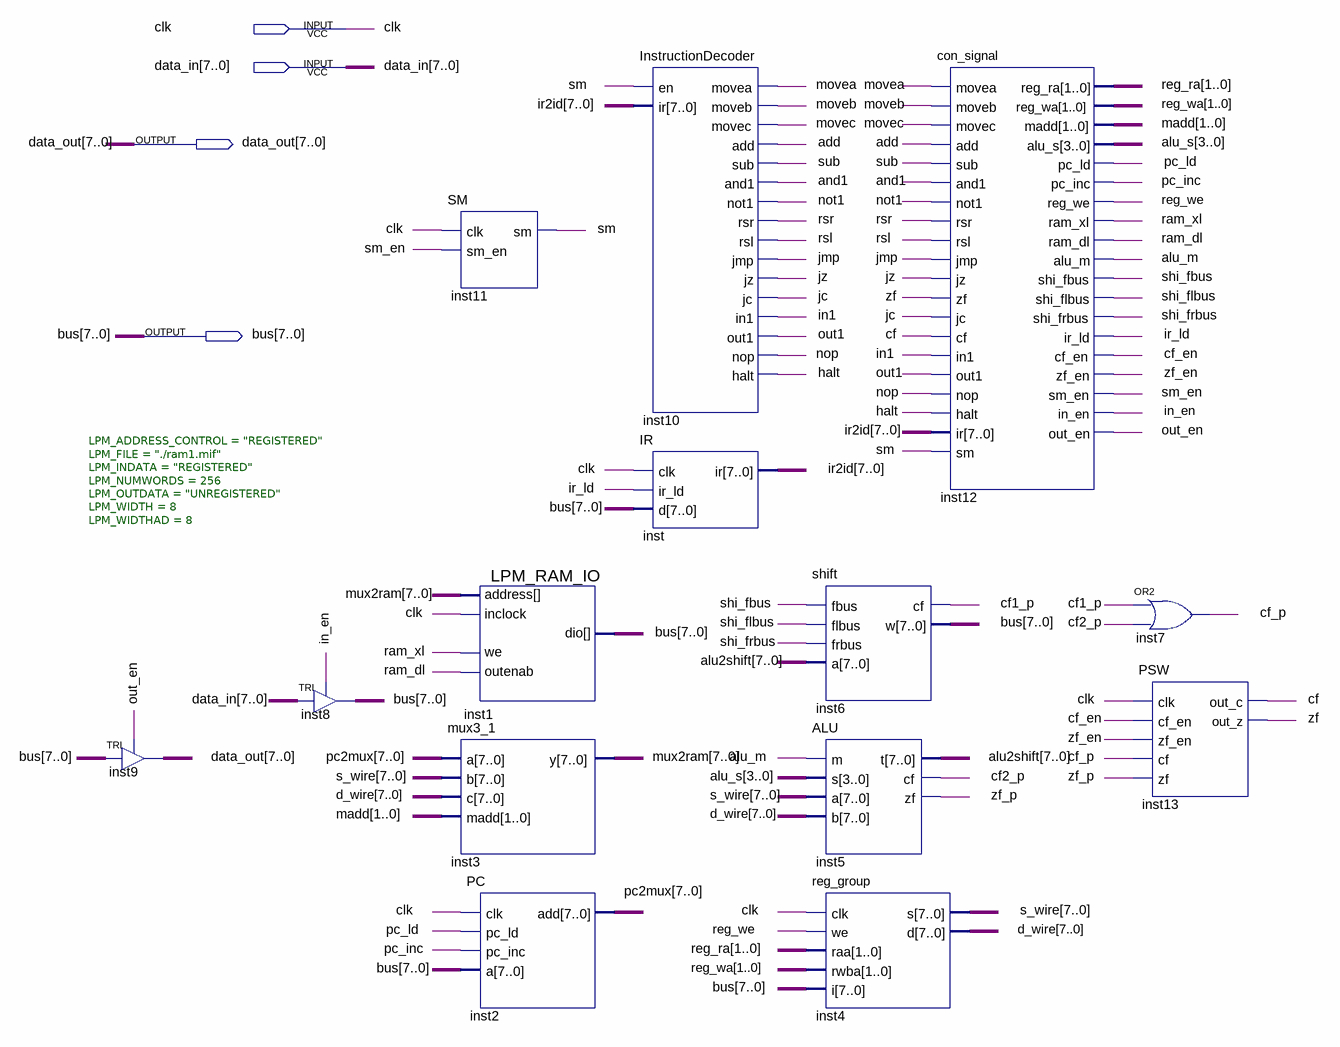
[diagram p0: schematic sheet]
// Quartus schematic ModelMachine.bdf as structural Verilog: 14 symbols, 4 pins
module ModelMachine (
  input  clk,
  input  [7:0] data_in,
  output [7:0] data_out,
  output [7:0] bus
);

  wire add, alu_m, and1, cf, cf1_p, cf2_p, cf_en, cf_p, halt, in1, in_en, ir_ld, jc, jmp, jz, movea, moveb,
       movec, nop, not1, out1, out_en, pc_inc, pc_ld, ram_dl, ram_xl, reg_we, rsl, rsr, shi_fbus, shi_flbus,
       shi_frbus, sm, sm_en, sub, zf, zf_en, zf_p;
  wire [1:0] madd, reg_ra, reg_wa;
  wire [3:0] alu_s;
  wire [7:0] alu2shift, d_wire, ir2id, mux2ram, pc2mux, s_wire;

  TRI inst9[7:0] (.IN(bus), .OE(out_en), .OUT(data_out));
  TRI inst8[7:0] (.IN(data_in), .OE(in_en), .OUT(bus));
  SM inst11 (.clk(clk), .sm_en(sm_en), .sm(sm));
  LPM_RAM_IO #(.LPM_ADDRESS_CONTROL("REGISTERED"), .LPM_FILE("./ram1.mif"), .LPM_INDATA("REGISTERED"), .LPM_NUMWORDS(256), .LPM_OUTDATA("UNREGISTERED"), .LPM_WIDTH(8), .LPM_WIDTHAD(8)) inst1 (
    .address(mux2ram), .inclock(clk), .we(ram_xl), .outenab(ram_dl), .dio(bus));
  mux3_1 inst3 (.a(pc2mux), .b(s_wire), .c(d_wire), .madd(madd), .y(mux2ram));
  PC inst2 (.clk(clk), .pc_ld(pc_ld), .pc_inc(pc_inc), .a(bus), .add(pc2mux));
  InstructionDecoder inst10 (
    .en(sm), .ir(ir2id), .movea(movea), .moveb(moveb), .movec(movec), .add(add), .sub(sub), .and1(and1),
    .not1(not1), .rsr(rsr), .rsl(rsl), .jmp(jmp), .jz(jz), .jc(jc), .in1(in1), .out1(out1), .nop(nop),
    .halt(halt));
  IR inst (.clk(clk), .ir_ld(ir_ld), .d(bus), .ir(ir2id));
  shift inst6 (.fbus(shi_fbus), .flbus(shi_flbus), .frbus(shi_frbus), .a(alu2shift), .cf(cf1_p), .w(bus));
  ALU inst5 (.m(alu_m), .s(alu_s), .a(s_wire), .b(d_wire), .t(alu2shift), .cf(cf2_p), .zf(zf_p));
  reg_group inst4 (.clk(clk), .we(reg_we), .raa(reg_ra), .rwba(reg_wa), .i(bus), .s(s_wire), .d(d_wire));
  con_signal inst12 (
    .movea(movea), .moveb(moveb), .movec(movec), .add(add), .sub(sub), .and1(and1), .not1(not1), .rsr(rsr),
    .rsl(rsl), .jmp(jmp), .jz(jz), .zf(zf), .jc(jc), .cf(cf), .in1(in1), .out1(out1), .nop(nop), .halt(halt),
    .ir(ir2id), .sm(sm), .reg_ra(reg_ra), .reg_wa(reg_wa), .madd(madd), .alu_s(alu_s), .pc_ld(pc_ld),
    .pc_inc(pc_inc), .reg_we(reg_we), .ram_xl(ram_xl), .ram_dl(ram_dl), .alu_m(alu_m), .shi_fbus(shi_fbus),
    .shi_flbus(shi_flbus), .shi_frbus(shi_frbus), .ir_ld(ir_ld), .cf_en(cf_en), .zf_en(zf_en), .sm_en(sm_en),
    .in_en(in_en), .out_en(out_en));
  or inst7 (cf_p, cf1_p, cf2_p);
  PSW inst13 (.clk(clk), .cf_en(cf_en), .zf_en(zf_en), .cf(cf_p), .zf(zf_p), .out_c(cf), .out_z(zf));
endmodule
